# Altium project Revolution.PrjPCB
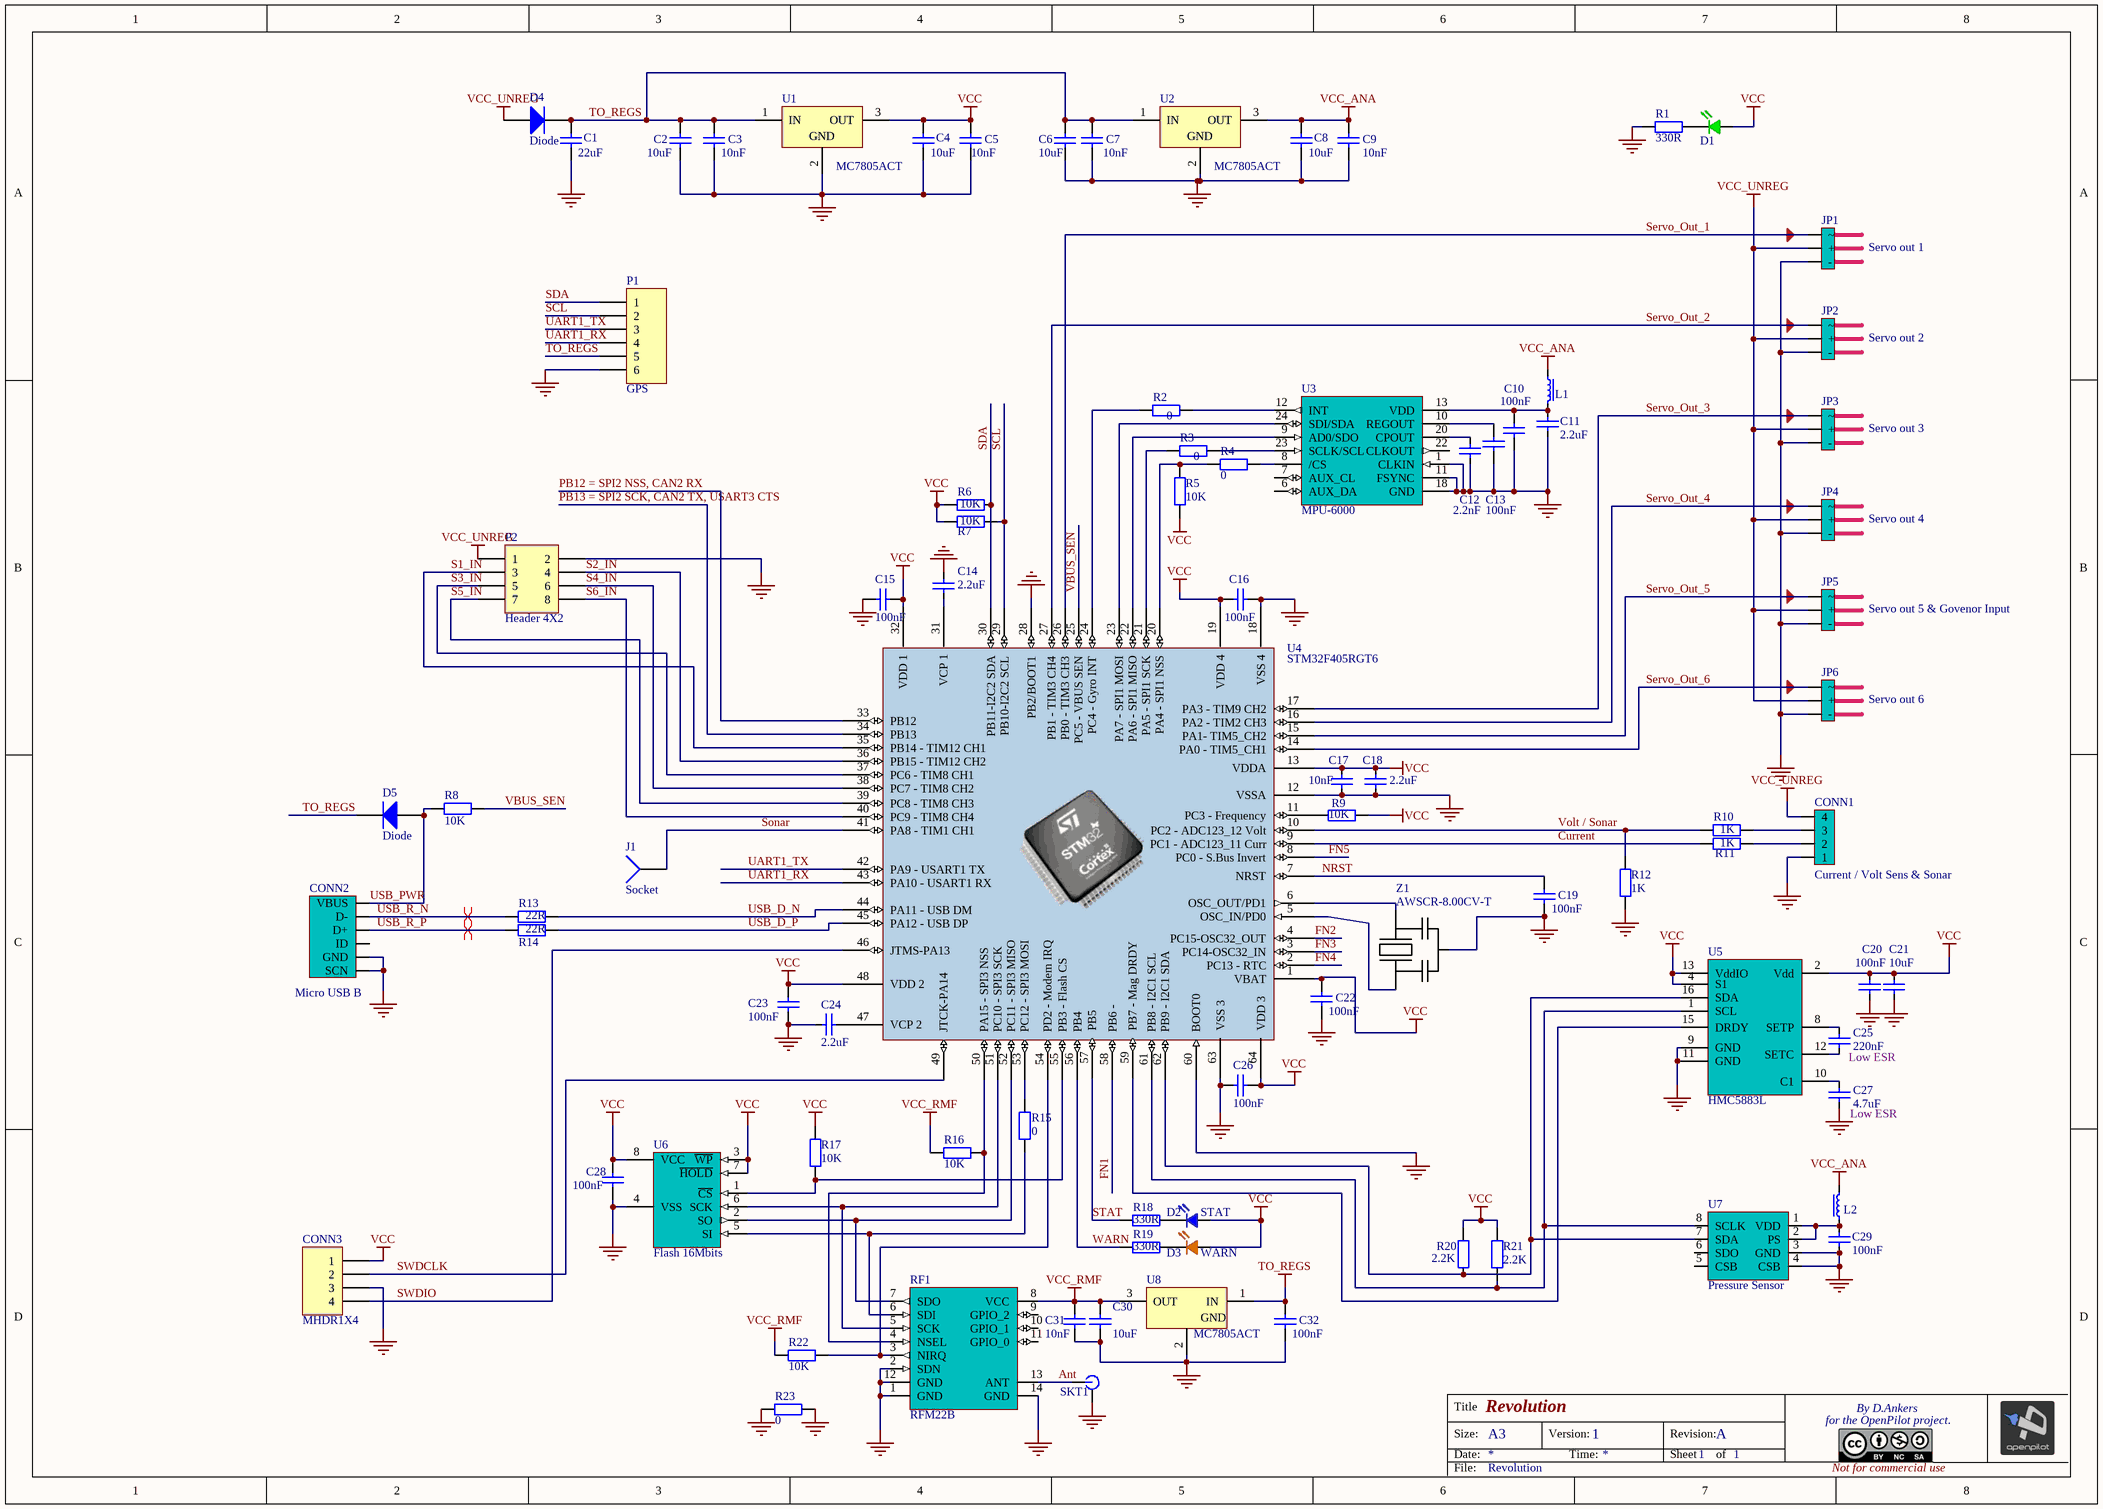
[diagram p0: Revolution.SchDoc]
1 sheet, 85 parts. Net scope: global (net labels, ports and power ports of the same name join across sheets).
Board file: Revolution.PcbDoc

## Sheet Revolution.SchDoc: Revolution
size A3; Author: D. Ankers; CompanyName: The OpenPilot Project; DrawnBy: D. Ankers; Engineer: D. Ankers; Organization: The OpenPilot Project; DocumentNumber: 1; Revision: A; SheetNumber: 1; SheetTotal: 1; DocumentName: Revolution; ProjectName: Revolution

### Parts
C1  value 22uF  [CAP805L]  (hidden comment: Cap805)
C2  value 10uF  [CAP805L]  (hidden comment: Cap805)
C3  value 10nF  [CAP402N]  (hidden comment: 10n)
C4  value 10uF  [CAP805L]  (hidden comment: Cap805)
C5  value 10nF  [CAP402N]  (hidden comment: 10n)
C6  value 10uF  [CAP805L]  (hidden comment: Cap805)
C7  value 10nF  [CAP402N]  (hidden comment: 10n)
C8  value 10uF  [CAP805L]  (hidden comment: Cap805)
C9  value 10nF  [CAP402N]  (hidden comment: 10n)
C10  value 100nF  [CAP402N]  (hidden comment: Cap402)
C11  value 2.2uF  [CAP603L]  (hidden comment: Cap603)
C12  value 2.2nF  [CAP603L]  (hidden comment: Cap603)
C13  value 100nF  [0402x]  (hidden comment: Cap402)
C14  value 2.2uF  [CAP603L]  (hidden comment: Cap603)
C15  value 100nF  [CAP402N]  (hidden comment: Cap402)
C16  value 100nF  [ERA-0603]  (hidden comment: Cap402)
C17  value 10nF  [ERA-0603]  (hidden comment: 10n)
C18  value 2.2uF  [CAP603L]  (hidden comment: Cap603)
C19  value 100nF  [CAP402N]  (hidden comment: Cap402)
C20  value 100nF  [CAP402N]  (hidden comment: Cap402)
C21  value 10uF  [CAP805L]  (hidden comment: Cap805)
C22  value 100nF  [CAP402N]  (hidden comment: Cap402)
C23  value 100nF  [ERA-0603]  (hidden comment: Cap402)
C24  value 2.2uF  [CAP603L]  (hidden comment: Cap603)
C25  value 220nF  [CAP603L]  (hidden comment: Cap603)
C26  value 100nF  [CAP402N]  (hidden comment: Cap402)
C27  value 4.7uF  [CAP603L]  (hidden comment: Cap603)
C28  value 100nF  [ERA-0603]  (hidden comment: Cap402)
C29  value 100nF  [CAP402N]  (hidden comment: Cap402)
C30  value 10uF  [CAP805L]  (hidden comment: Cap805)
C31  value 10nF  [CAP402N]  (hidden comment: 10n)
C32  value 100nF  [0603x]  (hidden comment: Cap402)
CONN1  Current / Volt Sens & Sonar  [HDR1X4]
CONN2  Micro USB B  [Micro_USB]
CONN3  MHDR1X4  [MHDR1X4]
D1  Green  [0805x]  (value not drawn)
D2  STAT  [0805x]
D3  WARN  [0805x]
D4  Diode  [SMC]
D5  Diode  [SMC]
J1  Socket  [PIN1]
JP1  Servo out 1  [SIP3 - 0.1]
JP2  Servo out 2  [SIP3 - 0.1]
JP3  Servo out 3  [SIP3 - 0.1]
JP4  Servo out 4  [SIP3 - 0.1]
JP5  Servo out 5 & Govenor Input  [SIP3 - 0.1]
JP6  Servo out 6  [SIP3 - 0.1]
L1  FB 300mA  [1206x]  (value not drawn)
L2  FB 300mA  [1206x]  (value not drawn)
P1  GPS  [HDR1X6_2MM_PITCH]
P2  Header 4X2  [HDR2X4]
R1  value 330R  [0805x]  (hidden comment: Res402)
R2  value 0  [0805x]  (hidden comment: Res402)
R3  value 0  [0805x]  (hidden comment: Res402)
R4  value 0  [0603x]  (hidden comment: Res402)
R5  value 10K  [ERA-0603]  (hidden comment: Res402)
R6  value 10K  [ERA-0603]  (hidden comment: Res402)
R7  value 10K  [ERA-0603]  (hidden comment: Res402)
R8  value 10K  [RES402N]  (hidden comment: Res402)
R9  value 10K  [ERA-0603]  (hidden comment: Res402)
R10  value 1K  [0805x]  (hidden comment: Res402)
R11  value 1K  [0805x]  (hidden comment: Res402)
R12  value 1K  [ERA-0603]  (hidden comment: Res402)
R13  value 22R  [0603x]  (hidden comment: Res402)
R14  value 22R  [0603x]  (hidden comment: Res402)
R15  value 0  [0805x]  (hidden comment: Res402)
R16  value 10K  [ERA-0603]  (hidden comment: Res402)
R17  value 10K  [0805x]  (hidden comment: Res402)
R18  value 330R  [0805x]  (hidden comment: Res402)
R19  value 330R  [0805x]  (hidden comment: Res402)
R20  value 2.2K  [0805x]  (hidden comment: Res402)
R21  value 2.2K  [0805x]  (hidden comment: Res402)
R22  value 10K  [ERA-0603]  (hidden comment: Res402)
R23  value 0  [0603x]  (hidden comment: Res402)
RF1  RFM22B  [RFM22B]
SKT1  MMCX Thru hole  [MCX5.08-H5]  (value not drawn)
U1  MC7805ACT  [SOT23-3_L]
U2  MC7805ACT  [SOT23-3_L]
U3  MPU-6000  [IMU-3000]
U4  STM32F405RGT6  [STM32 64 Lead]
U5  HMC5883L  [LPCC-16]
U6  Flash 16Mbits  [SOIC8_N]
U7  Pressure Sensor  [MS5611-01BA03]
U8  MC7805ACT  [SOT23-3_L]
Z1  AWSCR-8.00CV-T  [CRYSTAL_CERAMIC]

### Nets
GND: C1.2 C2.2 C3.2 C4.2 C5.2 C6.2 C7.2 C8.2 C9.2 C10.1 C11.2 C12.1 C13.2 C14.1 C15.2 C16.1 C17.2 C18.1 C19.1 C20.2 C21.1 C22.1 C23.2 C24.1 C26.2 C27.2 C28.1 C29.2 C30.2 C31.2 C32.1 CONN1.1 CONN2.0(SCN) CONN2.5(GND) CONN3.3 JP1.3(-) JP2.3(-) JP3.3(-) JP4.3(-) JP5.3(-) JP6.3(-) P1.6 P2.2 R1.1 R12.1 R23.1 R23.2 RF1.1(N.C) RF1.2(SDN) RF1.12(GND) RF1.14(N.C) SKT1.2(GND) U1.2(GND) U2.2(GND) U3.1(CLKIN) U3.11(FSYNC) U3.18(GND) U4.12(VSSA) U4.18(VSS_4) U4.28(PB2/BOOT1) U4.60(BOOT0) U4.63(VSS_3) U5.9(GND) U5.11(GND) U6.4(VSS) U7.3(GND) U7.4(CSB) U8.2(GND) Z1.2(GND)
TO_REGS: C1.1 C2.1 C3.1 C6.1 C7.1 C32.2 D4.2(K) D5.2(K) P1.5 U1.1(IN) U2.1(IN) U8.1(IN)
VCC: C4.1 C5.1 C15.1 C16.2 C17.1 C18.2 C20.1 C21.2 C22.2 C23.1 C26.1 C28.2 CONN3.1 D1.2(A) D2.2(A) D3.2(A) R5.1 R6.2 R7.2 R9.1 R17.1 R20.1 R21.1 U1.3(OUT) U4.1(VBAT) U4.13(VDDA) U4.19(VDD_4) U4.32(VDD_1) U4.48(VDD_2) U4.64(VDD_3) U5.2(Vdd) U5.4(S1) U5.13(VddIO) U6.3(~{WP}) U6.7(~{HOLD}) U6.8(VCC)
VCC_ANA: C8.1 C9.1 L1.1 L2.2 U2.3(OUT)
VCC_RMF: C30.1 C31.1 R16.1 R22.2 RF1.8(N.C) U8.3(OUT)
VCC_UNREG: CONN1.4 D4.1(A) JP1.2(+) JP2.2(+) JP3.2(+) JP4.2(+) JP5.2(+) JP6.2(+) P2.1
Ant: RF1.13(ANT) SKT1.1(PIN)
Current: R11.1 U4.9(PC1_-_ADC123_11_Curr)
FN1: U4.58(PB6_-)
FN2: U4.4(PC15-OSC32_OUT)
FN3: U4.3(PC14-OSC32_IN)
FN4: U4.2(PC13_-_RTC)
FN5: U4.8(PC0_-_S.Bus_Invert)
NRST: C19.2 U4.7(NRST)
PB12 = SPI2 NSS, CAN2 RX: U4.33(PB12)
PB13 = SPI2 SCK, CAN2 TX, USART3 CTS: U4.34(PB13)
S1_IN: P2.3 U4.35(PB14_-_TIM12_CH1)
S2_IN: P2.4 U4.36(PB15_-_TIM12_CH2)
S3_IN: P2.5 U4.37(PC6_-_TIM8_CH1)
S4_IN: P2.6 U4.38(PC7_-_TIM8_CH2)
S5_IN: P2.7 U4.39(PC8_-_TIM8_CH3)
S6_IN: P2.8 U4.40(PC9_-_TIM8_CH4)
SCL: P1.2 R7.1 U4.29(PB10-I2C2_SCL)
SDA: P1.1 R6.1 U4.30(PB11-I2C2_SDA)
Servo_Out_1: JP1.1 U4.26(PB0_-_TIM3_CH3)
Servo_Out_2: JP2.1 U4.27(PB1_-_TIM3_CH4)
Servo_Out_3: JP3.1 U4.17(PA3_-_TIM9_CH2)
Servo_Out_4: JP4.1 U4.16(PA2_-_TIM2_CH3)
Servo_Out_5: JP5.1 U4.15(PA1-_TIM5_CH2)
Servo_Out_6: JP6.1 U4.14(PA0_-_TIM5_CH1)
Sonar: J1.1 U4.41(PA8_-_TIM1_CH1)
STAT: R18.2 U4.57(PB5)
SWDCLK: CONN3.2 U4.49(JTCK-PA14)
SWDIO: CONN3.4 U4.46(JTMS-PA13)
UART1_RX: P1.4 U4.43(PA10_-_USART1_RX)
UART1_TX: P1.3 U4.42(PA9_-_USART1_TX)
USB_D_N: R13.1 U4.44(PA11_-_USB_DM)
USB_D_P: R14.1 U4.45(PA12_-_USB_DP)
USB_PWR: CONN2.1(VBUS) D5.1(A) R8.1
USB_R_N: CONN2.2(D-) R13.2
USB_R_P: CONN2.3(D+) R14.2
VBUS_SEN: R8.2 U4.25(PC5_-_VBUS_SEN)
Volt / Sonar: R10.1 R12.2 U4.10(PC2_-_ADC123_12_Volt)
WARN: R19.2 U4.56(PB4)
NetC10_2: C10.2 C11.1 L1.2 U3.13(VDD)
NetC12_2: C12.2 U3.20(CPOUT)
NetC13_1: C13.1 U3.10(REGOUT)
NetC14_2: C14.2 U4.31(VCP_1)
NetC24_2: C24.2 U4.47(VCP_2)
NetC25_1: C25.1 U5.12(SETC)
NetC25_2: C25.2 U5.8(NC)
NetC27_1: C27.1 U5.10(C1)
NetC29_1: C29.1 L2.1 U7.1(VDD) U7.2(PS)
NetCONN1_2: CONN1.2 R11.2
NetCONN1_3: CONN1.3 R10.2
NetD1_1: D1.1(K) R1.2
NetD2_1: D2.1(K) R18.1
NetD3_1: D3.1(K) R19.1
NetR2_1: R2.1 U3.12(INT)
NetR2_2: R2.2 U4.24(PC4_-_Gyro_INT)
NetR3_1: R3.1 U3.23(SCLK/SCL)
NetR3_2: R3.2 U4.21(PA5_-_SPI1_SCK)
NetR4_1: R4.1 R5.2 U4.20(PA4_-_SPI1_NSS)
NetR4_2: R4.2 U3.8(/CS)
NetR9_2: R9.2 U4.11(PC3_-_Frequency)
NetR15_1: R15.1 U4.53(PC12_-_SPI3_MOSI)
NetR15_2: R15.2 RF1.6(SDI) U6.5(SI)
NetR16_2: R16.2 RF1.4(N.C) U4.50(PA15_-_SPI3_NSS)
NetR17_2: R17.2 U4.55(PB3_-_Flash_CS) U6.1(~{CS})
NetR20_2: R20.2 U4.62(PB9_-_I2C1_SDA) U5.16(SDA) U7.7(SDA)
NetR21_2: R21.2 U4.61(PB8_-_I2C1_SCL) U5.1(SCL) U7.8(SCLK)
NetR22_1: R22.1 RF1.3(NIRQ) U4.54(PD2_-_Modem_IRQ)
NetRF1_5: RF1.5(SCK) U4.51(PC10_-_SPI3_SCK) U6.6(SCK)
NetRF1_7: RF1.7(SDO) U4.52(PC11_-_SPI3_MISO) U6.2(SO)
NetU3_9: U3.9(AD0/SDO) U4.22(PA6_-_SPI1_MISO)
NetU3_24: U3.24(SDI/SDA) U4.23(PA7_-_SPI1_MOSI)
NetU4_5: U4.5(OSC_IN/PD0) Z1.1(X1)
NetU4_6: U4.6(OSC_OUT/PD1) Z1.3(X2)
NetU4_59: U4.59(PB7_-_Mag_DRDY) U5.15(DRDY)

Not connected (* = marked no-connect by the designer): CONN2 4(ID); RF1 9(N.C) 10(GPIO_1) 11(GPIO_0); U3 2(NC) 3(NC) 4(NC) 5(NC) 6(AUX_DA) 7(AUX_CL) 14(NC) 15(NC) 16(NC) 17(NC) 19(RESV) 21(RESV) 22(CLKOUT); U5 3(NC) 5(NC) 6(NC) 7(NC) 14(NC); U7 5(CSB) 6(SDO)

### Layout directives
differential pair: USB_R_N, USB_R_P

### Notes on the sheet
- (near C25) Low ESR
- (near C27) Low ESR
- Title
- Size:
- Date:
- A3
- Version:
- Time:
- Revision:
- Sheet
- of
- for the OpenPilot project.
- By D.Ankers
- File:
- Not for commercial use

### Library data of the parts
C1 C2 C4 C6 C8 C21 C30 = Cap805: Capacitor SMD; Published: 1-Nov-2010; LatestRevisionDate: 1-Nov-2010; LatestRevisionNote: Released OpenPilot Lib; PackageReference: 0805 (2012 Metric); Publisher: The OpenPilot Project; Supplier 1: Digi-Key
  C1: Supplier Part Number 1: 587-1958-1-ND
  C2 C4 C6 C8 C21 C30: Supplier Part Number 1: 490-3886-1-ND
C3 C5 C7 C9 C10 C13 C15-C17 C19 C20 C22 C23 C26 C28 C29 C31 C32 = Cap402: Capacitor SMD; Publisher: The OpenPilot Project; Published: 1-Nov-2010; LatestRevisionDate: 1-Nov-2010; LatestRevisionNote: Released OpenPilot Lib; PackageReference: 0402 (1005 Metric); ComponentLink2Description: Datasheet; Supplier 1: Digi-Key
  C3 C5 C7 C9 C17 C31: Supplier Part Number 1: 587-1223-1-ND
  C10 C13 C15 C16 C19 C20 C22 C23 C26 C28 C29 C32: Supplier Part Number 1: 445-4952-1-ND
C11 C12 C14 C18 C24 C25 C27 = Cap603: Capacitor SMD; Published: 1-Nov-2010; LatestRevisionDate: 1-Nov-2010; LatestRevisionNote: Released OpenPilot Lib; PackageReference: 0603 (1608 Metric); Publisher: The OpenPilot Project; Supplier 1: Digi-Key
  C11 C14 C18 C24: Supplier Part Number 1: 445-5175-1-ND
  C12: Supplier Part Number 1: 445-1309-1-ND
  C25: Supplier Part Number 1: 445-1318-1-ND
  C27: Supplier Part Number 1: 445-5178-1-ND
CONN1 = JST-SH 4-pin Side Entry Socket: Manufacturer: Generic Components; Class: Connector; Supplier 1: Digi-Key; Supplier Part Number 1: 455-1804-1-ND
CONN2 = USB Micro B SMT: USB Micro B SMT Socket; Class: Connector; ComponentLink2Description: Datasheet; LatestRevisionDate: 1-Nov-2010; LatestRevisionNote: Released OpenPilot Lib; Published: 1-Nov-2010; Publisher: The OpenPilot Project; Supplier 1: Digi-Key; Supplier Part Number 1: WM17141CT-ND
CONN3 = MHDR1X4: Header, 4-Pin; LatestRevisionDate: 17-Jul-2002; LatestRevisionNote: Re-released for DXP Platform.; Publisher: Altium Limited
D1 = LED 603 Gr: Green 603 LED; Value: 2.1v 20mA; Supplier 1: Digi-Key; Supplier Part Number 1: 754-1116-1-ND
D2 = LED 603 Bl: Blue 603 LED; Supplier 1: Digi-Key; Supplier Part Number 1: 350-2037-1-ND
D3 = LED 603 Or: Orange 603 LED; Value: 2.1v 20mA; Supplier 1: Digi-Key; Supplier Part Number 1: 754-1120-1-ND
D4 D5 = Diode: Default Diode; Published: 8-Jun-2000; LatestRevisionDate: 17-Jul-2002; LatestRevisionNote: Re-released for DXP Platform.; PackageVersion: Sep-1996; PackageReference: SMC; Publisher: Altium Limited; PackageDescription: DO-214-AB/SMC; 2 C-Bend Leads; Body 7.9 x 5.9 mm, inc. leads (LxW); Code_JEDEC: DO-214-AB
JP1-JP6 = Hdr 3 Pin 0.1: Header, 3-Pin, 0.1"; Manufacturer: Generic Components; Class: Connector; Supplier 1: Digi-Key; Supplier Part Number 1: MTLW-103-23-S-S-260-ND
L1 L2 = FerriteBead 300mA: Ferrite Bead 300mA; Manufacturer: Generic Components; Class: Passive; Supplier 1: Digi-Key; Supplier Part Number 1: 732-1586-1-ND; ComponentLink2Description: Datasheet; LatestRevisionDate: 1-Nov-2010; LatestRevisionNote: Released OpenPilot Lib; Published: 1-Nov-2010; Publisher: The OpenPilot Project
P1 = Header 6: Header, 6-Pin; LatestRevisionDate: 17-Jul-2002; LatestRevisionNote: Re-released for DXP Platform.; Publisher: Altium Limited
P2 = Header 4X2: Header, 4-Pin, Dual row; LatestRevisionDate: 17-Jul-2002; LatestRevisionNote: Re-released for DXP Platform.; Publisher: Altium Limited
R1-R23 = Res402: Resistor SMD; Published: 1-Nov-2010; LatestRevisionDate: 1-Nov-2010; LatestRevisionNote: Released OpenPilot Lib; PackageReference: 0402 ( 1005 Metric); Publisher: The OpenPilot Project; ComponentLink2Description: Datasheet; Supplier 1: Digi-Key
  R1 R18 R19: Supplier Part Number 1: P330LCT-ND
  R2-R9 R15-R17 R22 R23: Supplier Part Number 1: P10.0KLCT-ND
  R10-R12: Supplier Part Number 1: P1.00KLCT-ND
  R13 R14: Supplier Part Number 1: P22.0LCT-ND
  R20 R21: Supplier Part Number 1: P2.20KLCT-ND
RF1 = RFM22B-S2: UHF 100mW Transceiver
SKT1 = MMCX Thru hole: MMCX Socket; Supplier 1: Digi-Key; Supplier Part Number 1: ARF1729-ND
U1 U2 U8 = MC7805ACT: 3-Terminal Positive Fixed Voltage Regulator; Note: Pin 2 is electrically connected to TAB; Published: 17-Jul-2002; DatasheetVersion: 1988; PackageReference: 221A-04; Publisher: Altium Limited; PackageDescription: TO, Thru-Hole, Vertical, Heatsink Mounted; 3 In-Line Leads; Pitch 2.54 mm; Code_JEDEC: TO-262-AA; ComponentLink1Description: Manufacturer Link; ComponentLink1URL: http://www.onsemi.com/site/products/taxonomy/0,4438,503,00.html; ComponentLink2Description: Datasheet; ComponentLink2URL: http://www.onsemi.com/pub/Collateral/MC7800-D.PDF
U3 = MPU-3/6000: Invensense MPU-3/6000,  3-axis Gyros & Accel on 6000; ComponentLink2Description: Datasheet; LatestRevisionDate: 1-Nov-2010; LatestRevisionNote: Released OpenPilot Lib; Published: 1-Nov-2010; Publisher: The OpenPilot Project; Manufacturer: Invensense; Supplier 1: Invensense; Supplier Part Number 1: MPU-6000
U4 = STM32F103RET6: STM32 ARM-based 32-bit MCU with 1MB Flash, 64-pin LQFP, Industrial Temperature; Supplier 1: Digi-Key; Supplier Part Number 1: 497-11767-ND
U5 = HMC5883L: IC, Magnetometer, 3 axis, +/- 8 Oe, I2C, 160Hz; Manufacturer: Honeywell; Supplier 1: Digi-Key; Supplier Part Number 1: 342-1082-1-ND; ComponentLink2Description: Datasheet; LatestRevisionDate: 13 Jan 2011; LatestRevisionNote: Initial version; Published: 13 Jan 2011; Publisher: The OpenPilot Project; ManufacturerPartNo: HMC5883L; Value: HMC5883L
U6 = Flash 16Mb 75MHZ 8SOIC: 16Mbit SPI Flash Memory; ComponentLink2Description: Datasheet; LatestRevisionDate: 1-Nov-2010; LatestRevisionNote: Released OpenPilot Lib; Published: 1-Nov-2010; Publisher: The OpenPilot Project; Supplier 1: Digi-Key; Supplier Part Number 1: M25P16-VMN6P-ND
U7 = MS5611-01BA03: Pressure Sensor - MS5611-01BA03
Z1 = Crystal_smd_with_caps: Value: CER RES 8.0000MHZ 22PF SMD; Order Number: AWSCR-8.00CV-T; Distributor: Abracon LLC; Package: 3-SMD, Non-Standard
J1 = Socket: LatestRevisionDate: 17-Jul-2002; LatestRevisionNote: Re-released for DXP Platform.; Publisher: Altium Limited